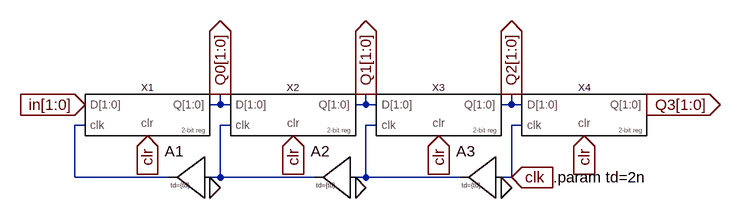
[diagram p0: schematic shift_reg-2bit-4len.asc]
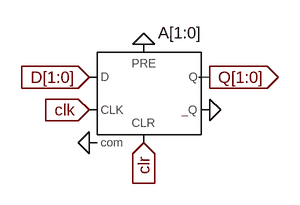
[diagram p1: sub-circuit dbuf_2bit.asc]
shift_reg-2bit-4len.asc, the LTspice schematic file:
Version 4
SHEET 1 1316 680
WIRE 256 96 256 80
WIRE 256 96 240 96
WIRE 272 96 256 96
WIRE 480 96 480 80
WIRE 480 96 464 96
WIRE 496 96 480 96
WIRE 704 96 704 80
WIRE 704 96 688 96
WIRE 720 96 704 96
WIRE 48 128 32 128
WIRE 272 128 256 128
WIRE 496 128 480 128
WIRE 720 128 704 128
WIRE 32 208 32 128
WIRE 176 208 32 208
WIRE 256 208 256 128
WIRE 256 208 240 208
WIRE 400 208 256 208
WIRE 480 208 480 128
WIRE 480 208 464 208
WIRE 624 208 480 208
WIRE 704 208 704 128
WIRE 704 208 688 208
FLAG 144 144 clr
IOPIN 144 144 In
FLAG 368 144 clr
IOPIN 368 144 In
FLAG 592 144 clr
IOPIN 592 144 In
FLAG 240 224 0
FLAG 464 224 0
FLAG 48 96 in[1:0]
IOPIN 48 96 In
FLAG 256 80 Q0[1:0]
IOPIN 256 80 Out
FLAG 480 80 Q1[1:0]
IOPIN 480 80 Out
FLAG 816 144 clr
IOPIN 816 144 In
FLAG 704 208 clk
IOPIN 704 208 In
FLAG 688 224 0
FLAG 912 96 Q3[1:0]
IOPIN 912 96 Out
FLAG 704 80 Q2[1:0]
IOPIN 704 80 Out
SYMBOL Digital\\buf1 240 144 M0
WINDOW 3 31 76 Left 0
SYMATTR Value td={td}
SYMATTR InstName A1
SYMBOL dbuf_2bit 144 112 R0
SYMATTR InstName X1
SYMBOL dbuf_2bit 368 112 R0
SYMATTR InstName X2
SYMBOL dbuf_2bit 592 112 R0
SYMATTR InstName X3
SYMBOL dbuf_2bit 816 112 R0
SYMATTR InstName X4
SYMBOL Digital\\buf1 464 144 M0
WINDOW 3 31 76 Left 0
SYMATTR Value td={td}
SYMATTR InstName A2
SYMBOL Digital\\buf1 688 144 M0
WINDOW 3 31 76 Left 0
SYMATTR Value td={td}
SYMATTR InstName A3
TEXT 768 208 Left 2 !.param td=2n

dbuf_2bit.asc, the sub-circuit schematic file:
Version 4
SHEET 1 880 680
WIRE 224 128 208 128
FLAG 48 224 0
FLAG 224 128 Q[1:0]
IOPIN 224 128 Out
FLAG 128 224 clr
IOPIN 128 224 In
FLAG 48 128 D[1:0]
IOPIN 48 128 In
FLAG 48 176 clk
IOPIN 48 176 In
FLAG 224 176 0
FLAG 128 80 0
SYMBOL Digital\\dflop 128 80 R0
WINDOW 0 21 -17 Left 2
SYMATTR InstName A[1:0]

The netlist it stands for:
* shift_reg-2bit-4len.asc
A1 N002 0 0 0 0 0 N001 0 BUF td={td}
XX1 N001 clr in[1] in[0] Q0[1] Q0[0] dbuf_2bit
XX2 N002 clr Q0[1] Q0[0] Q1[1] Q1[0] dbuf_2bit
XX3 N003 clr Q1[1] Q1[0] Q2[1] Q2[0] dbuf_2bit
XX4 clk clr Q2[1] Q2[0] Q3[1] Q3[0] dbuf_2bit
A2 N003 0 0 0 0 0 N002 0 BUF td={td}
A3 clk 0 0 0 0 0 N003 0 BUF td={td}

* block symbol definitions
.subckt dbuf_2bit clk clr D[1] D[0] Q[1] Q[0]
A[1:0] D[1:0] 0 clk 0 clr 0 Q[1:0] 0 DFLOP
.ends dbuf_2bit

.param td=2n
.backanno
.end